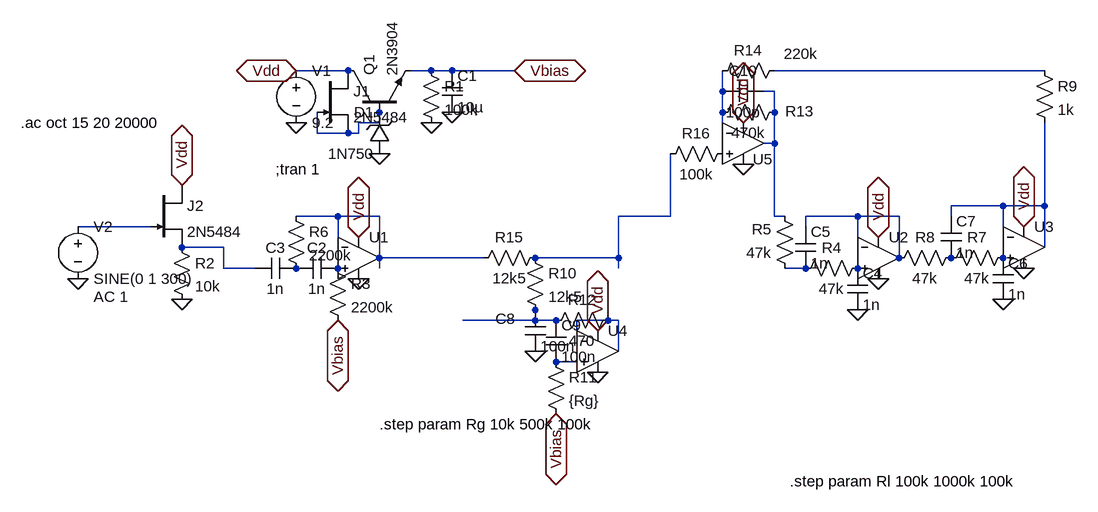
[diagram p0: schematic Cabsim.asc]
Cabsim.asc, the LTspice schematic file:
Version 4
SHEET 1 1668 680
WIRE 48 -32 -32 -32
WIRE 176 -32 144 -32
WIRE 208 -32 176 -32
WIRE 304 -32 208 -32
WIRE 1120 -32 704 -32
WIRE 624 0 624 -32
WIRE 704 0 688 0
WIRE 624 32 624 0
WIRE 704 32 704 0
WIRE 96 48 96 32
WIRE 96 48 64 48
WIRE 0 64 0 32
WIRE 48 64 0 64
WIRE 64 64 64 48
WIRE 64 64 48 64
WIRE 624 64 624 32
WIRE 704 80 704 32
WIRE 704 80 688 80
WIRE 1056 176 976 176
WIRE 1120 176 1120 48
WIRE 1120 176 1056 176
WIRE 32 192 -32 192
WIRE 96 192 32 192
WIRE 544 192 544 96
WIRE 544 192 464 192
WIRE 704 192 704 80
WIRE 720 192 704 192
WIRE 832 192 752 192
WIRE 896 192 832 192
WIRE 976 192 976 176
WIRE -256 208 -368 208
WIRE 752 208 752 192
WIRE 1056 224 1056 176
WIRE -144 240 -208 240
WIRE 32 240 32 192
WIRE 832 240 832 192
WIRE 1120 240 1120 176
WIRE 96 256 96 192
WIRE 256 256 96 256
WIRE 464 256 464 192
WIRE 464 256 336 256
WIRE 896 256 896 192
WIRE -144 272 -144 240
WIRE -96 272 -144 272
WIRE 96 272 96 256
WIRE 464 272 464 256
WIRE 752 272 720 272
WIRE 336 352 336 336
WIRE 336 352 224 352
WIRE 368 352 336 352
WIRE 448 352 400 352
WIRE 464 352 448 352
WIRE 400 384 400 352
WIRE 464 400 464 352
WIRE 400 416 368 416
FLAG 176 48 0
FLAG 208 32 0
FLAG 96 96 0
FLAG -32 48 0
FLAG -32 -32 Vdd
IOPIN -32 -32 BiDir
FLAG 304 -32 Vbias
IOPIN 304 -32 BiDir
FLAG -368 288 0
FLAG -208 320 0
FLAG -208 144 Vdd
IOPIN -208 144 BiDir
FLAG 64 224 Vdd
IOPIN 64 224 BiDir
FLAG 864 224 Vdd
IOPIN 864 224 BiDir
FLAG 64 288 0
FLAG 864 288 0
FLAG 32 352 Vbias
IOPIN 32 352 BiDir
FLAG 832 336 0
FLAG 1088 208 Vdd
IOPIN 1088 208 BiDir
FLAG 1088 272 0
FLAG 1056 320 0
FLAG 656 112 0
FLAG 656 48 Vdd
IOPIN 656 48 BiDir
FLAG 432 368 Vdd
IOPIN 432 368 BiDir
FLAG 432 432 0
FLAG 336 400 0
FLAG 368 496 Vbias
IOPIN 368 496 BiDir
SYMBOL voltage -32 -48 R0
WINDOW 123 0 0 Left 0
WINDOW 39 0 0 Left 0
SYMATTR InstName V1
SYMATTR Value 9.2
SYMBOL npn 48 32 R270
SYMATTR InstName Q1
SYMATTR Value 2N3904
SYMBOL cap 192 -32 R0
SYMATTR InstName C1
SYMATTR Value 10µ
SYMBOL res 160 -48 R0
SYMATTR InstName R1
SYMATTR Value 100k
SYMBOL zener 112 96 R180
WINDOW 0 24 64 Left 2
WINDOW 3 24 0 Left 2
SYMATTR InstName D1
SYMATTR Value 1N750
SYMATTR Description Diode
SYMATTR Type diode
SYMBOL njf 0 -32 R0
SYMATTR InstName J1
SYMATTR Value 2N5484
SYMBOL Opamps\\UniversalOpamp2 64 256 R0
SYMATTR InstName U1
SYMBOL Opamps\\UniversalOpamp2 864 256 R0
SYMATTR InstName U2
SYMBOL njf -256 144 R0
SYMATTR InstName J2
SYMATTR Value 2N5484
SYMBOL res -224 224 R0
SYMATTR InstName R2
SYMATTR Value 10k
SYMBOL voltage -368 192 R0
WINDOW 123 24 124 Left 2
WINDOW 39 0 0 Left 0
SYMATTR Value2 AC 1
SYMATTR InstName V2
SYMATTR Value SINE(0 1 300)
SYMBOL cap 32 256 R90
WINDOW 0 0 32 VBottom 2
WINDOW 3 32 32 VTop 2
SYMATTR InstName C2
SYMATTR Value 1n
SYMBOL cap -32 256 R90
WINDOW 0 0 32 VBottom 2
WINDOW 3 32 32 VTop 2
SYMATTR InstName C3
SYMATTR Value 1n
SYMBOL res 16 256 R0
SYMATTR InstName R3
SYMATTR Value 2200k
SYMBOL res -48 176 R0
SYMATTR InstName R6
SYMATTR Value 2200k
SYMBOL cap 816 272 R0
SYMATTR InstName C4
SYMATTR Value 1n
SYMBOL cap 736 208 R0
SYMATTR InstName C5
SYMATTR Value 1n
SYMBOL res 848 256 R90
WINDOW 0 0 56 VBottom 2
WINDOW 3 32 56 VTop 2
SYMATTR InstName R4
SYMATTR Value 47k
SYMBOL Opamps\\UniversalOpamp2 1088 240 R0
SYMATTR InstName U3
SYMBOL cap 1040 256 R0
SYMATTR InstName C6
SYMATTR Value 1n
SYMBOL cap 960 192 R0
SYMATTR InstName C7
SYMATTR Value 1n
SYMBOL res 1072 240 R90
WINDOW 0 0 56 VBottom 2
WINDOW 3 32 56 VTop 2
SYMATTR InstName R7
SYMATTR Value 47k
SYMBOL res 992 240 R90
WINDOW 0 0 56 VBottom 2
WINDOW 3 32 56 VTop 2
SYMATTR InstName R8
SYMATTR Value 47k
SYMBOL Opamps\\UniversalOpamp2 656 80 R0
WINDOW 0 15 24 Left 2
SYMATTR InstName U5
SYMBOL res 720 16 R90
WINDOW 0 30 -23 VBottom 2
WINDOW 3 32 56 VTop 2
SYMATTR InstName R13
SYMATTR Value 470k
SYMBOL res 720 -48 R90
WINDOW 0 0 56 VBottom 2
WINDOW 3 -26 -25 VTop 2
SYMATTR InstName R14
SYMATTR Value 220k
SYMBOL res 640 80 R90
WINDOW 0 0 56 VBottom 2
WINDOW 3 32 56 VTop 2
SYMATTR InstName R16
SYMATTR Value 100k
SYMBOL res 736 288 R180
WINDOW 0 36 76 Left 2
WINDOW 3 36 40 Left 2
SYMATTR InstName R5
SYMATTR Value 47k
SYMBOL res 1104 -48 R0
SYMATTR InstName R9
SYMATTR Value 1k
SYMBOL Opamps\\UniversalOpamp2 432 400 R0
SYMATTR InstName U4
SYMBOL res 320 240 R0
SYMATTR InstName R10
SYMATTR Value 12k5
SYMBOL cap 320 336 R0
WINDOW 0 -45 14 Left 2
SYMATTR InstName C8
SYMATTR Value 100n
SYMBOL res 352 400 R0
SYMATTR InstName R11
SYMATTR Value {Rg}
SYMBOL res 464 336 R90
WINDOW 0 0 56 VBottom 2
WINDOW 3 32 56 VTop 2
SYMATTR InstName R12
SYMATTR Value 470
SYMBOL cap 352 352 R0
SYMATTR InstName C9
SYMATTR Value 100n
SYMBOL res 352 240 R90
WINDOW 0 0 56 VBottom 2
WINDOW 3 32 56 VTop 2
SYMATTR InstName R15
SYMATTR Value 12k5
SYMBOL cap 688 -16 R90
WINDOW 0 0 32 VBottom 2
WINDOW 3 32 32 VTop 2
SYMATTR InstName C10
SYMATTR Value 100p
TEXT -64 120 Left 2 !;tran 1
TEXT -456 48 Left 2 !.ac oct 15 20 20000
TEXT 728 600 Left 2 !.step param Rl 100k 1000k 100k
TEXT 96 512 Left 2 !.step param Rg 10k 500k 100k

The netlist it stands for:
* Cabsim.asc
V1 Vdd 0 9.2
Q1 Vdd N004 Vbias 0 2N3904
C1 Vbias 0 10µ
R1 Vbias 0 100k
D1 0 N004 1N750
J1 Vdd N004 N004 2N5484
XU1 P001 N006 Vdd 0 N006 level.2 Avol=1Meg GBW=10Meg Slew=10Meg ilimit=25m rail=0 Vos=0 phimargin=45 en=0 enk=0 in=0 ink=0 Rin=500Meg  ; pins IN+ IN- V+ V- OUT
XU2 P002 N008 Vdd 0 N008 level.2 Avol=1Meg GBW=10Meg Slew=10Meg ilimit=25m rail=0 Vos=0 phimargin=45 en=0 enk=0 in=0 ink=0 Rin=500Meg  ; pins IN+ IN- V+ V- OUT
J2 Vdd N009 N010 2N5484
R2 N010 0 10k
V2 N009 0 SINE(0 1 300) AC 1
C2 P001 P003 1n
C3 P003 N010 1n
R3 P001 Vbias 2200k
R6 N006 P003 2200k
C4 P002 0 1n
C5 N008 N011 1n
R4 P002 N011 47k
XU3 P004 N005 Vdd 0 N005 level.2 Avol=1Meg GBW=10Meg Slew=10Meg ilimit=25m rail=0 Vos=0 phimargin=45 en=0 enk=0 in=0 ink=0 Rin=500Meg  ; pins IN+ IN- V+ V- OUT
C6 P004 0 1n
C7 N005 P005 1n
R7 P004 P005 47k
R8 P005 N008 47k
XU5 P006 N002 Vdd 0 N003 level.2 Avol=1Meg GBW=10Meg Slew=10Meg ilimit=25m rail=0 Vos=0 phimargin=45 en=0 enk=0 in=0 ink=0 Rin=500Meg  ; pins IN+ IN- V+ V- OUT
R13 N003 N002 470k
R14 N001 N002 220k
R16 P006 N007 100k
R5 N011 N003 47k
R9 N001 N005 1k
XU4 N014 N013 Vdd 0 N013 level.2 Avol=1Meg GBW=10Meg Slew=10Meg ilimit=25m rail=0 Vos=0 phimargin=45 en=0 enk=0 in=0 ink=0 Rin=500Meg  ; pins IN+ IN- V+ V- OUT
R10 N007 N012 12k5
C8 N012 0 100n
R11 N014 Vbias {Rg}
R12 N013 N012 470
C9 N012 N014 100n
R15 N007 N006 12k5
C10 N003 N002 100p
.model D D
.lib standard.dio
.model NPN NPN
.model PNP PNP
.lib standard.bjt
.model NJF NJF
.model PJF PJF
.lib standard.jft
;tran 1
.ac oct 15 20 20000
.step param Rl 100k 1000k 100k
.step param Rg 10k 500k 100k
.lib UniversalOpamps2.sub
.backanno
.end